# EAGLE design openSX70_SONAR-FBW_8-9-3-8-S4-TCS3200-NO-THERMAL-20200509 (EAGLE 9.6.1)
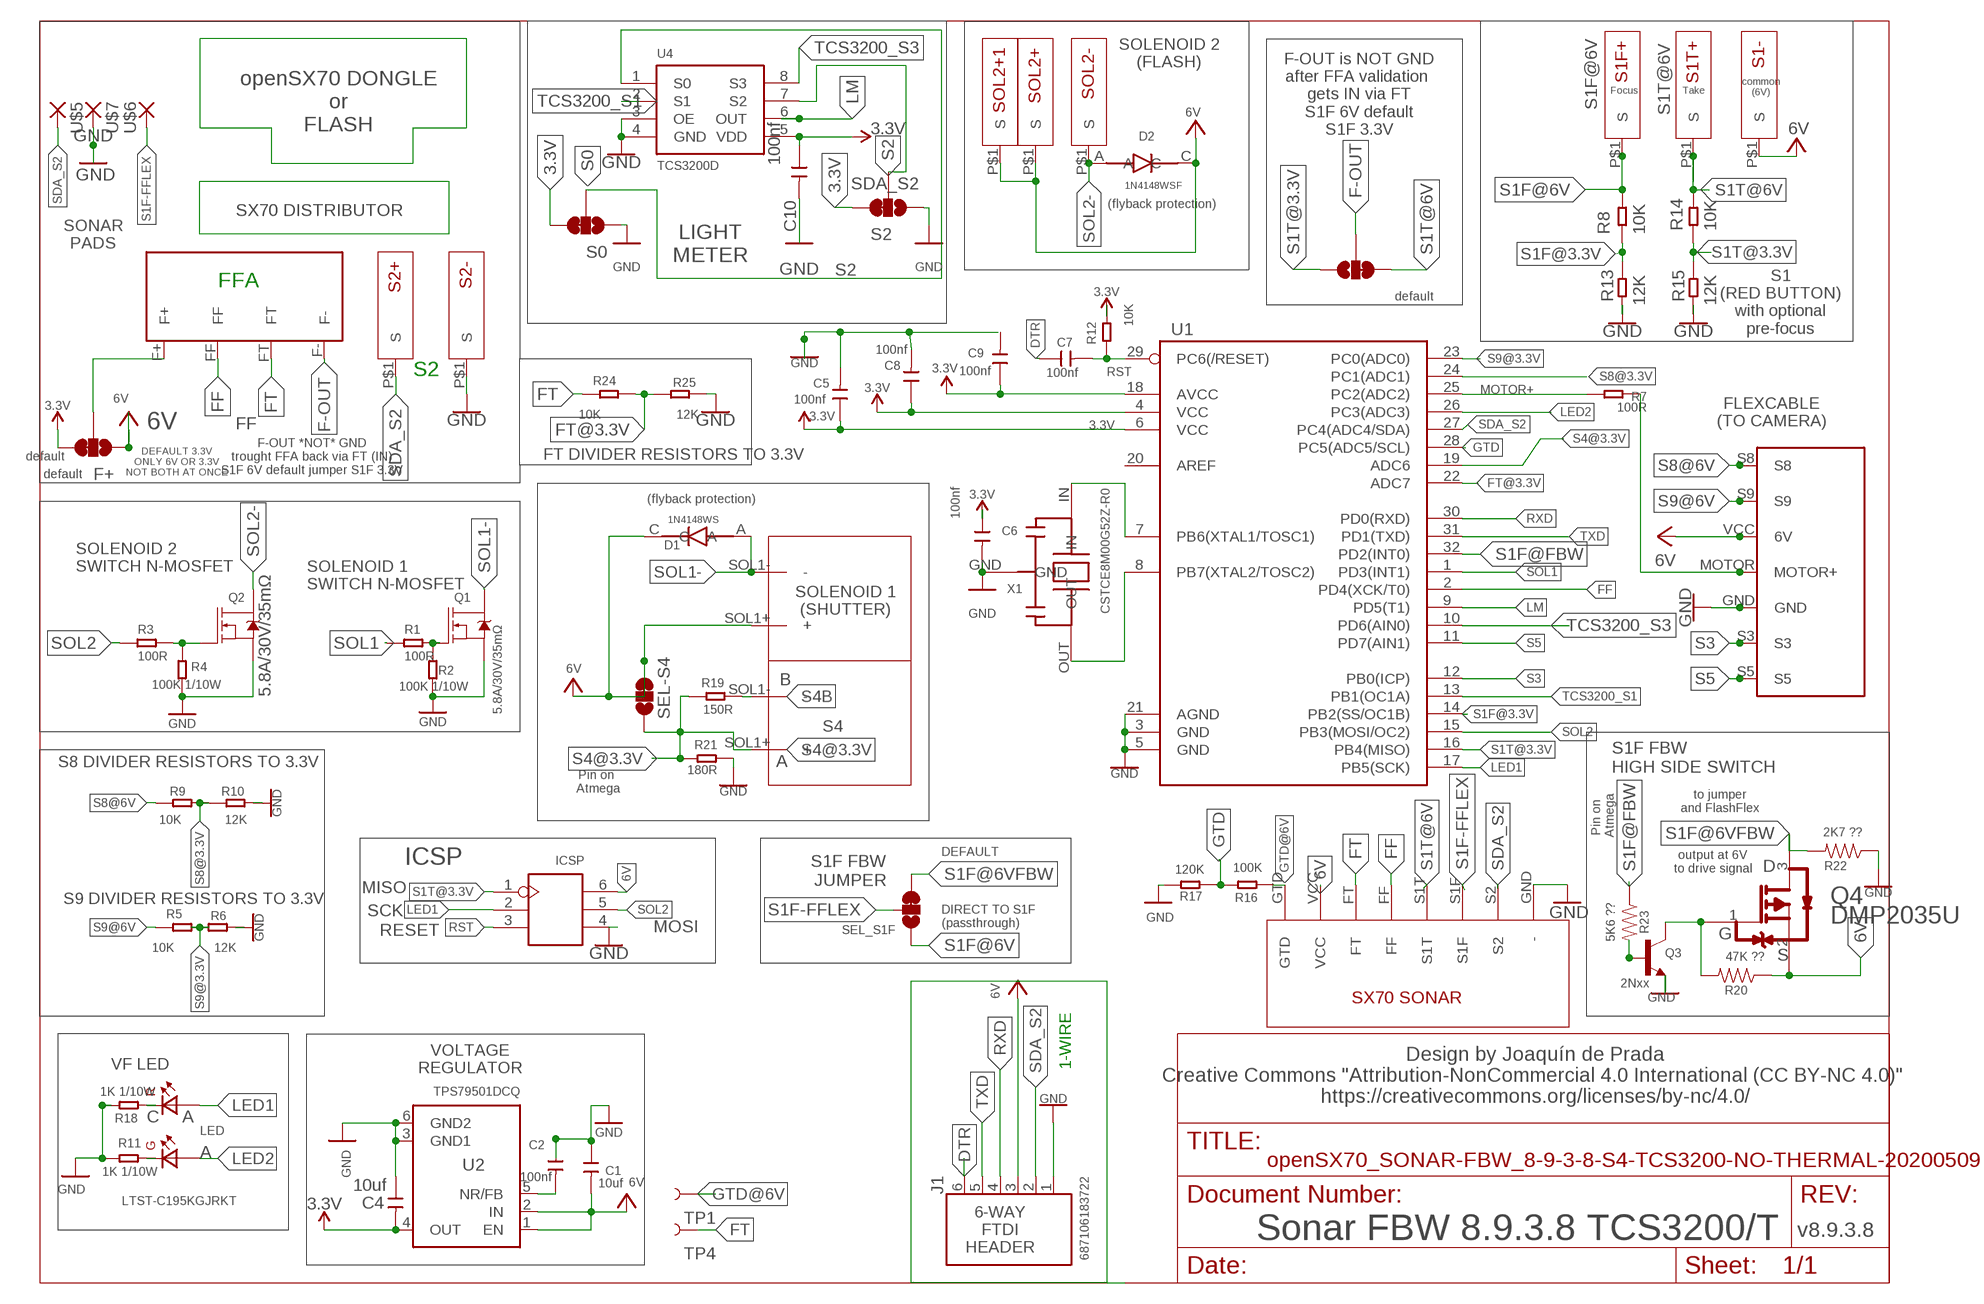
[diagram p0: schematic, sheet 1]

## Parts
C1  10uf  CERAMIC-10UF-10V-10%-X5R(0603)  [C0603]
C2  100nf  CERAMIC-100NF-50V-10%-X7R(0603)  [C0603]
C4  10uf  CERAMIC-10UF-10V-10%-X5R(0603)  [C0603]
C5  100nf  CERAMIC-100NF-50V-10%-X7R(0603)  [C0603]
C6  100nf  CERAMIC-100NF-50V-10%-X7R(0603)  [C0603]
C7  100nf  CERAMIC-100NF-50V-10%-X7R(0603)  [C0603]
C8  100nf  CERAMIC-100NF-50V-10%-X7R(0603)  [C0603]
C9  100nf  CERAMIC-100NF-50V-10%-X7R(0603)  [C0603]
C10  100nf  CERAMIC-100NF-50V-10%-X7R(0603)  [C0603]
D1  1N4148WS  [SODFL2512X100N]
D2  1N4148WSF  1N4148WS  [SODFL2512X100N]
F+  S0  JUMPER-SMT_3_1-NC_TRACE_SILK  [SMT-JUMPER_3_1-NC_TRACE_SILK]
ICSP  ICSP  [H2X3-2.54]
J1  687106183722  [687106183722]
LED  LTST-C195KGJRKT  [LTST-BILED-15X16]
Q1  5.8A/30V/35mΩ  MOSFET-NCH-AO3404A  [SOT23-3]
Q2  5.8A/30V/35mΩ  MOSFET-NCH-AO3404A  [SOT23-3]
Q3  BFR93-NPN-SOT23-BEC  [SOT23-BEC]
Q4  DIODES_INC._DMP2035UDIODES_INC._DMP2035U_0_2  [DIODES_INC._DMP2035U_2]
R1  100R  SMD-RES-100R-5%-1/10W(0603)  [R0603]
R2  100K 1/10W  SMD-RES-100K-5%-1/10W(0603)  [R0603]
R3  100R  SMD-RES-100R-5%-1/10W(0603)  [R0603]
R4  100K 1/10W  SMD-RES-100K-5%-1/10W(0603)  [R0603]
R5  10K  SMD-RES-15K-1%-1/10W(0603)  [R0603]
R6  12K  SMD-RES-10K-1%-1/10W(0603)  [R0603]
R7  100R  SMD-RES-100R-5%-1/10W(0603)  [R0603]
R8  10K  SMD-RES-10K-1%-1/10W(0603)  [R0603]
R9  10K  SMD-RES-15K-1%-1/10W(0603)  [R0603]
R10  12K  SMD-RES-10K-1%-1/10W(0603)  [R0603]
R11  1K 1/10W  SMD-RES-1K-5%-1/10W(0603)  [R0603]
R12  10K  SMD-RES-10K-1%-1/10W(0603)  [R0603]
R13  12K  SMD-RES-15K-1%-1/10W(0603)  [R0603]
R14  10K  SMD-RES-10K-1%-1/10W(0603)  [R0603]
R15  12K  SMD-RES-15K-1%-1/10W(0603)  [R0603]
R16  100K  SMD-RES-10K-1%-1/10W(0603)  [R0603]
R17  120K  SMD-RES-15K-1%-1/10W(0603)  [R0603]
R18  1K 1/10W  SMD-RES-1K-5%-1/10W(0603)  [R0603]
R19  150R  SMD-RES-10K-1%-1/10W(0603)  [R0603]
R20  47K  RESISTOR0603  [0603]
R21  180R  SMD-RES-10K-1%-1/10W(0603)  [R0603]
R22  2K7  RESISTOR0603  [0603]
R23  47K  RESISTOR0603  [0603]
R24  10K  SMD-RES-15K-1%-1/10W(0603)  [R0603]
R25  12K  SMD-RES-10K-1%-1/10W(0603)  [R0603]
S0  S0  JUMPER-SMT_3_1-NC_TRACE_SILK  [SMT-JUMPER_3_1-NC_TRACE_SILK]
S1-  SX70-S-PAD-NEW  [SX70-S-PAD2]
S1F+  SX70-S-PAD-NEW  [SX70-S-PAD2]
S1T+  SX70-S-PAD-NEW  [SX70-S-PAD2]
S2  S2  JUMPER-SMT_3_1-NC_TRACE_SILK  [SMT-JUMPER_3_1-NC_TRACE_SILK]
S2+  SX70-S-PAD-NEW  [SX70-S-PAD2]
S2-  SX70-S-PAD-NEW  [SX70-S-PAD2]
S4  SX70-SOLENOID1-2PADS  [SX70-SOLENOID1-2]
SEL_F-  SEL-S4  JUMPER-SMT_3_1-NC_TRACE_SILK  [SMT-JUMPER_3_1-NC_TRACE_SILK]
SEL_S1F  SEL-S4  JUMPER-SMT_3_1-NC_TRACE_SILK  [SMT-JUMPER_3_1-NC_TRACE_SILK]
SEL_S4  SEL-S4  JUMPER-SMT_3_1-NC_TRACE_SILK  [SMT-JUMPER_3_1-NC_TRACE_SILK]
SOL1  SX70-SOLENOID1-2PADS  [SX70-SOLENOID1-2]
SOL2+  SX70-S-PAD-NEW  [SX70-S-PAD2]
SOL2+1  SX70-S-PAD-NEW  [SX70-S-PAD2]
SOL2-  SX70-S-PAD-NEW  [SX70-S-PAD2]
TP1  TEST-POINT3X4  [PAD.03X.04]
TP4  TEST-POINT3X4  [PAD.03X.04]
U1  ATMEGA328P_32MLFATMEGA328-MLF  [MLF32]
U2  TPS79501DCQ  [SOT127P706X180-6N]
U4  TCS3200D  [SOIC8]
U$1  SX70-7-PAD  [SX70-7-PAD-PROPER]
U$2  FFA  SX70-FFA-PAD  [FFA-PAD-PACKAGE]
U$3  SX70-SONAR-FLASHFLEX  [SONAR-FLASHFLEX]
U$5  S2-SONAR  [S2-SONAR]
U$6  S1F@6V  S2-SONAR  [S2-SONAR]
U$7  GND-SONAR  [GND-SONAR]
X1  CSTCE8M00G52Z-R0  CSTCE16M0V53-R0  [CFP95P160X100-3N]

## Nets
3.3V: C4.2 C5.1 C6.1 C8.1 C9.1 C10.1 F+.3 R12.2 S0.3 S2.3 U1.4(VCC) U1.6(VCC) U1.18(AVCC) U2.4(OUT) U4.5(VDD)
6V: C1.2 D1.C D2.C F+.1 ICSP.6(VCC) J1.3 Q4.2(S) R20.1 S1-.P$1(S) SEL_S4.2 SEL_S4.3 SOL1.SOL1+(+) SOL2+1.P$1(S) SOL2+.P$1(S) U2.1(EN) U2.2(IN) U$1.VCC(6V) U$3.VCC
DTR: C7.1 J1.6
F-OUT: SEL_F-.2 U$2.F-
FF: U1.2(PD4(XCK/T0)) U$2.FF U$3.FF
FT: R24.1 TP4.P$1 U$2.FT U$3.FT
FT@3.3V: R24.2 R25.1 U1.22(ADC7)
GND: C1.1 C2.1 C4.1 C5.2 C6.2 C8.2 C10.2 ICSP.4(GND) J1.1 Q1.2(S) Q2.2(S) Q3.E R2.1 R4.1 R6.2 R10.2 R11.1 R13.1 R15.1 R17.1 R18.2 R21.1 R22.1 R25.2 S0.1 S2-.P$1(S) S2.1 U1.3(GND) U1.5(GND) U1.21(AGND) U2.3(GND1) U2.6(GND2) U4.3(OE) U4.4(GND) U$1.GND U$3.GND(-) U$7.GND-SONAR(P) X1.GND
GTD: R16.2 R17.2 U1.28(PC5(ADC5/SCL))
GTD@6V: R16.1 TP1.P$1 U$3.GTD
LED1: ICSP.2(SCK) LED.P$2(A2) U1.17(PB5(SCK))
LED2: LED.P$1(A1) U1.26(PC3(ADC3))
LM: U1.9(PD5(T1)) U4.6(OUT)
MOTOR+: R7.1 U1.25(PC2(ADC2))
MOTOR-HEADER: R7.2 U$1.MOTOR(MOTOR+)
N$1: Q1.1(G) R1.2 R2.2
N$2: LED.P$4(K2) R18.1
N$3: Q2.1(G) R3.2 R4.2
N$4: U1.7(PB6(XTAL1/TOSC1)) X1.IN
N$5: F+.2 U$2.F+
N$6: U1.8(PB7(XTAL2/TOSC2)) X1.OUT
N$7: Q3.C Q4.1(G) R20.2
N$8: Q3.B R23.2
N$10: C2.2 U2.5(NR/FB)
N$11: LED.P$3(K1) R11.2
RST: C7.2 ICSP.3(RST) R12.1 U1.29(PC6(/RESET))
RXD: J1.4 U1.30(PD0(RXD))
S0: S0.2 U4.1(S0)
S1F-FFLEX: SEL_S1F.2 U$3.S1F U$6.S2-SONAR(P)
S1F@3.3V: R8.1 R13.2 U1.14(PB2(SS/OC1B))
S1F@6V: R8.2 S1F+.P$1(S) SEL_S1F.1
S1F@6VFBW: Q4.3(D) R22.2 SEL_S1F.3
S1F@FBW: R23.1 U1.32(PD2(INT0))
S1T@3.3V: ICSP.1(MISO) R14.1 R15.2 SEL_F-.1 U1.16(PB4(MISO))
S1T@6V: R14.2 S1T+.P$1(S) SEL_F-.3 U$3.S1T
S2: S2.2 U4.7(S2)
S3: U1.12(PB0(ICP)) U$1.S3
S4@3.3V: R19.1 R21.2 S4.SOL1+(+) SEL_S4.1 U1.19(ADC6)
S4B: R19.2 S4.SOL1-(-)
S5: U1.11(PD7(AIN1)) U$1.S5
S8@3.3V: R9.2 R10.1 U1.24(PC1(ADC1))
S8@6V: R9.1 U$1.S8
S9@3.3V: R5.2 R6.1 U1.23(PC0(ADC0))
S9@6V: R5.1 U$1.S9
SDA_S2: J1.2 S2+.P$1(S) U1.27(PC4(ADC4/SDA)) U$3.S2 U$5.S2-SONAR(P)
SOL1: R1.1 U1.1(PD3(INT1))
SOL1-: D1.A Q1.3(D) SOL1.SOL1-(-)
SOL2: ICSP.5(MOSI) R3.1 U1.15(PB3(MOSI/OC2))
SOL2-: D2.A Q2.3(D) SOL2-.P$1(S)
TCS3200_S1: U1.13(PB1(OC1A)) U4.2(S1)
TCS3200_S3: U1.10(PD6(AIN0)) U4.8(S3)
TXD: J1.5 U1.31(PD1(TXD))
Unconnected: C9.2 U1.20(AREF)

## Notes on the sheet
- SOLENOID 2
  (FLASH)
- common
  (6V)
- Focus | Take
- F-OUT is NOT GND
  after FFA validation 
  gets IN via FT
  S1F 6V default
  S1F 3.3V
- openSX70 DONGLE
  or
  FLASH
- (flyback protection)
- SX70 DISTRIBUTOR
- SONAR
  PADS
- LIGHT
  METER
- FFA
- default
- S1
  (RED BUTTON)
  with optional
  pre-focus
- S2
- FLEXCABLE
  (TO CAMERA)
- default
- F-OUT *NOT* GND
  trought FFA back via FT (IN)
  S1F 6V default jumper S1F 3.3V
- FT DIVIDER RESISTORS TO 3.3V
- DEFAULT 3.3V
  ONLY 6V OR 3.3V
  NOT BOTH AT ONCE
- default
- (flyback protection)
- SOLENOID 2
  SWITCH N-MOSFET
- SOLENOID 1
  SWITCH N-MOSFET
- SOLENOID 1
  (SHUTTER)
- B
- S4
- S8 DIVIDER RESISTORS TO 3.3V | A
- S1F FBW 
  HIGH SIDE SWITCH
- Pin on 
  Atmega
- to jumper
  and FlashFlex
- Pin on 
  Atmega
- 2K7 ??
- DEFAULT
- output at 6V
  to drive signal
- S1F FBW 
  JUMPER
- D
- MISO
- S9 DIVIDER RESISTORS TO 3.3V
- SCK
- DIRECT TO S1F 
  (passthrough)
- RESET | MOSI | SEL_S1F
- 5K6 ?? | G
- 47K ?? | S
- 2Nxx
- VOLTAGE
  REGULATOR
- 1-WIRE
- Design by Joaquín de Prada
  Creative Commons "Attribution-NonCommercial 4.0 International (CC BY-NC 4.0)" 
  https://creativecommons.org/licenses/by-nc/4.0/
- VF LED
- C | A
- A
- 6-WAY
  FTDI
  HEADER
- v8.9.3.8
- Sonar FBW 8.9.3.8 TCS3200/T

## Library data of the parts
C1 C4 = Seeed-Capacitor:CERAMIC-10UF-10V-10%-X5R(0603): 302010103; MPN: CC0603KRX5R6BB106
C2 C5-C10 = Seeed-Capacitor:CERAMIC-100NF-50V-10%-X7R(0603): 302010138; MPN: CC0603KRX7R9BB104
D1 D2 = Common-Parts-Library-Eagle:1N4148WS: 1N4148WS Series 75 V 300 mA Surface Mount Small Signal Diodes - SOD-323F; MANUFACTURER: Fairchild Semiconductor
F+ S0 S2 SEL_F- SEL_S1F SEL_S4 = SparkFun-Jumpers:JUMPER-SMT_3_1-NC_TRACE: Normally closed trace jumper (1 of 2 connections) This jumper has a trace between two pads so it's normally closed (NC). The other connection is normally open (NO). Use a razor knife to open the connection. For best results follow the IPC guidelines for cutting traces: Cutout at least 0.063 mm (0.005 in). Remove all loose material to clean up the cut area. Seal the cut with an approved epoxy. Reapply solder to reclose the connection, or to close the NO connection.
ICSP = openSX70:ICSP
J1 = 687106183722:687106183722: 687106183722 WR-FPC 0.50mm SMT Horizontal Bottom Contact - Low Profile Details see: http://katalog.we-online.de/en/em/FPC_0_5_SMT_ZIF_HORIZONTAL_BOTTOM_CONTACT_LOW_PROFILE_6871xx183722 Created by Yingchun,shan 2016 (C) Wurth Elektronik; AVAILABILITY: Good; DESCRIPTION: CONN FFC BTM 6POS 0.5MM SMD R/A; MF: Wurth Electronics; MP: 687106183722; PACKAGE: None; PRICE: 1.21 USD
LED = LTST-C195KGJRKT:LTST-C195KGJRKT; AVAILABILITY: Unavailable; DESCRIPTION: Green/Red 130° Water Clear 35/25 mcd 2 V 0605 Surface Mount Bi-Color LED; MF: Lite-On Inc.; MP: LTST-C195KGJRKT; PACKAGE: 0606 Lite-On; PRICE: None
Q1 Q2 = openSX70:MOSFET-NCH: N-channel MOSFETs Voltage controlled devices that allow control of high current outputs. SparkFun Products: SparkFun OpenScale <https://www.sparkfun.com/products/13261> SparkFun Digital Sandbox <https://www.sparkfun.com/products/12651> SparkFun Monster Moto Shield <https://www.sparkfun.com/products/10182> SparkFun MOSFET Power Controller <https://www.sparkfun.com/products/11214>; PROD_ID: TRANS-12988
Q3 = transistor-neu-to92:*-NPN-: NPN Transistror
Q4 = _openSX70:DIODES_INC._DMP2035U: MOSFET P-CH 20V 3.6A SOT-23; AUTOMOTIVE: No; CENTROID_NOT_SPECIFIED: No; CONTINUOUS_DRAIN_CURRENT: -4.9A; DATASHEET: https://www.diodes.com/assets/Datasheets/DMP2035U.pdf; DEPLETION_MODE: False; DEVICE_CLASS_L1: Discrete Semiconductors; DEVICE_CLASS_L2: Transistors; DEVICE_CLASS_L3: MOSFETs; DIGIKEY_DESCRIPTION: TRANS MOSFET P-CH 20V 3.6A SOT-23; DIGIKEY_PART_NUMBER: DMP2035U-7DICT-ND; DRAIN_TO_SOURCE_BREAKDOWN_VOLTAGE: -20V; DRAIN_TO_SOURCE_RESISTANCE: 23mΩ; DRAIN_TO_SOURCE_VOLTAGE: -20V; FOOTPRINT_PARAMETERS_1: {"fp_type":"SOT23","params":{"N":{"default":"3","long name":"Number of leads","type":"multichoice","short name":"N"},"A":{"nom":1024999,"long name":"Height","min":903000,"max":1100000,"short name":"A","type":"measurement"},"A1":{"nom":50000,"long name":"Package clearance","min":13000,"max":100000,"short name":"A1","type":"measurement"},"A2":{"nom":975000,"long name":"Package height","min":890000,"max":1000000,"short name":"A2","type":"measurement"},"D":{"nom":2900000,"long name":"Package length","min":2800000,"max":3000000,"short name":"D","type":"measurement"},"E":{"nom":2400000,"long name":"Width /w leads","min":2300000,"max":2500000,"short name":"E","type":"measurement"},"E1":{"nom":1300000,"long name":"Package width","min":1200000,"max":1400000,"short name":"E1","type":"measurement"},"B":{"nom":400000,"long name":"Lead width","min":370000,"max":510000,"short name":"B","type":"measurement"},"C":{"nom":110000,"long name":"Lead thickness","min":85000,"max":150000,"short name":"C","type":"measurement"},"L":{"nom":400000,"long name":"Lead foot length","min":250000,"max":550000,"short name":"L","type":"measurement"},"e":{"nom":915000,"long name":"Lead pitch","min":null,"max":null,"short name":"e","type":"measurement"},"PHI":{"nom":false,"long name":"Lead angle","min":0,"max":8,"short name":"PHI","type":"measurement"},"offset x":{"nom":0,"long name":"X Center offset","min":null,"max":null,"short name":"offset x","type":"measurement"},"offset y":{"nom":0,"long name":"Y Center offset","min":null,"max":null,"short name":"offset y","type":"measurement"},"LS":{"default":"Rounded rectangle","long name":"Land shape","type":"multichoice","short name":"LS"},"LS1":{"default":"Rectangle","long name":"Land shape (Pin 1)","type":"multichoice","short name":"LS1"},"solder toe":{"nom":550000,"long name":"Solder fillet (toe)","min":null,"max":null,"short name":"solder toe","type":"fixedmeasurement"},"solder heel":{"nom":450000,"long name":"Solder fillet (heel)","min":null,"max":null,"short name":"solder heel","type":"fixedmeasurement"},"solder side":{"nom":50000,"long name":"Solder fillet (side)","min":null,"max":null,"short name":"solder side","type":"fixedmeasurement"},"courtyard":{"nom":500000,"long name":"Courtyard","min":null,"max":null,"short name":"courtyard","type":"fixedmeasurement"},"SF":{"default":"A","long name":"Packing level","type":"multichoiceparent","short name":"SF","help":"http://support.upverter.com/customer/portal/articles/978783-what-is-a-footprint-packing-level","children":["solder toe","solder heel","solder side","courtyard"]}}}; FOOTPRINT_PARAMETERS_2: {"fp_type":"SOT23","params":{"N":{"default":"3","long name":"Number of leads","type":"multichoice","short name":"N"},"A":{"nom":1024999,"long name":"Height","min":903000,"max":1100000,"short name":"A","type":"measurement"},"A1":{"nom":50000,"long name":"Package clearance","min":13000,"max":100000,"short name":"A1","type":"measurement"},"A2":{"nom":975000,"long name":"Package height","min":890000,"max":1000000,"short name":"A2","type":"measurement"},"D":{"nom":2900000,"long name":"Package length","min":2800000,"max":3000000,"short name":"D","type":"measurement"},"E":{"nom":2400000,"long name":"Width /w leads","min":2300000,"max":2500000,"short name":"E","type":"measurement"},"E1":{"nom":1300000,"long name":"Package width","min":1200000,"max":1400000,"short name":"E1","type":"measurement"},"B":{"nom":400000,"long name":"Lead width","min":370000,"max":510000,"short name":"B","type":"measurement"},"C":{"nom":110000,"long name":"Lead thickness","min":85000,"max":150000,"short name":"C","type":"measurement"},"L":{"nom":400000,"long name":"Lead foot length","min":250000,"max":550000,"short name":"L","type":"measurement"},"e":{"nom":915000,"long name":"Lead pitch","min":null,"max":null,"short name":"e","type":"measurement"},"PHI":{"nom":false,"long name":"Lead angle","min":0,"max":8,"short name":"PHI","type":"measurement"},"offset x":{"nom":0,"long name":"X Center offset","min":null,"max":null,"short name":"offset x","type":"measurement"},"offset y":{"nom":0,"long name":"Y Center offset","min":null,"max":null,"short name":"offset y","type":"measurement"},"LS":{"default":"Rounded rectangle","long name":"Land shape","type":"multichoice","short name":"LS"},"LS1":{"default":"Rectangle","long name":"Land shape (Pin 1)","type":"multichoice","short name":"LS1"},"solder toe":{"nom":350000,"long name":"Solder fillet (toe)","min":null,"max":null,"short name":"solder toe","type":"fixedmeasurement"},"solder heel":{"nom":350000,"long name":"Solder fillet (heel)","min":null,"max":null,"short name":"solder heel","type":"fixedmeasurement"},"solder side":{"nom":30000,"long name":"Solder fillet (side)","min":null,"max":null,"short name":"solder side","type":"fixedmeasurement"},"courtyard":{"nom":250000,"long name":"Courtyard","min":null,"max":null,"short name":"courtyard","type":"fixedmeasurement"},"SF":{"default":"B","long name":"Packing level","type":"multichoiceparent","short name":"SF","help":"http://support.upverter.com/customer/portal/articles/978783-what-is-a-footprint-packing-level","children":["solder toe","solder heel","solder side","courtyard"]}}}; FOOTPRINT_PARAMETERS_3: {"fp_type":"SOT23","params":{"N":{"default":"3","long name":"Number of leads","type":"multichoice","short name":"N"},"A":{"nom":1024999,"long name":"Height","min":903000,"max":1100000,"short name":"A","type":"measurement"},"A1":{"nom":50000,"long name":"Package clearance","min":13000,"max":100000,"short name":"A1","type":"measurement"},"A2":{"nom":975000,"long name":"Package height","min":890000,"max":1000000,"short name":"A2","type":"measurement"},"D":{"nom":2900000,"long name":"Package length","min":2800000,"max":3000000,"short name":"D","type":"measurement"},"E":{"nom":2400000,"long name":"Width /w leads","min":2300000,"max":2500000,"short name":"E","type":"measurement"},"E1":{"nom":1300000,"long name":"Package width","min":1200000,"max":1400000,"short name":"E1","type":"measurement"},"B":{"nom":400000,"long name":"Lead width","min":370000,"max":510000,"short name":"B","type":"measurement"},"C":{"nom":110000,"long name":"Lead thickness","min":85000,"max":150000,"short name":"C","type":"measurement"},"L":{"nom":400000,"long name":"Lead foot length","min":250000,"max":550000,"short name":"L","type":"measurement"},"e":{"nom":915000,"long name":"Lead pitch","min":null,"max":null,"short name":"e","type":"measurement"},"PHI":{"nom":false,"long name":"Lead angle","min":0,"max":8,"short name":"PHI","type":"measurement"},"offset x":{"nom":0,"long name":"X Center offset","min":null,"max":null,"short name":"offset x","type":"measurement"},"offset y":{"nom":0,"long name":"Y Center offset","min":null,"max":null,"short name":"offset y","type":"measurement"},"LS":{"default":"Rounded rectangle","long name":"Land shape","type":"multichoice","short name":"LS"},"LS1":{"default":"Rectangle","long name":"Land shape (Pin 1)","type":"multichoice","short name":"LS1"},"solder toe":{"nom":150000,"long name":"Solder fillet (toe)","min":null,"max":null,"short name":"solder toe","type":"fixedmeasurement"},"solder heel":{"nom":250000,"long name":"Solder fillet (heel)","min":null,"max":null,"short name":"solder heel","type":"fixedmeasurement"},"solder side":{"nom":10000,"long name":"Solder fillet (side)","min":null,"max":null,"short name":"solder side","type":"fixedmeasurement"},"courtyard":{"nom":100000,"long name":"Courtyard","min":null,"max":null,"short name":"courtyard","type":"fixedmeasurement"},"SF":{"default":"C","long name":"Packing level","type":"multichoiceparent","short name":"SF","help":"http://support.upverter.com/customer/portal/articles/978783-what-is-a-footprint-packing-level","children":["solder toe","solder heel","solder side","courtyard"]}}}; FOOTPRINT_URL: https://www.diodes.com/assets/Package-Files/SOT23.pdf; FOOTPRINT_VARIANT_NAME_0: Recommended_Land_Pattern; FOOTPRINT_VARIANT_NAME_1: IPC_A; FOOTPRINT_VARIANT_NAME_2: IPC_B; FOOTPRINT_VARIANT_NAME_3: IPC_C; GATE_CHARGE_AT_VGS: 15.4nC @ -4.5V; GATE_TO_SOURCE_VOLTAGE: 10V; HEIGHT: 1.1mm; INPUT_CAPACITACE_AT_VDS: 1610pF @ -10V; IPC_LAND_PATTERN_NAME: SOT92P240X102-3; LEAD_FREE: Yes; MAX_FORWARD_DIODE_VOLTAGE: -1V; MAX_JUNCTION_TEMP: +150°C; MF: Diodes Inc.; MFG_PACKAGE_IDENT: SOT23; MFG_PACKAGE_IDENT_DATE: 01/2017; MFG_PACKAGE_IDENT_REV: 0; MOUSER_DESCRIPTION: MOSFET P-CH 20V 3.6A SOT-23; MOUSER_PART_NUMBER: 621-DMP2035U-7; MPN: DMP2035U; NUMBER_OF_CHANNELS: 1; NUMBER_OF_P_CHANNELS: 1; PACKAGE: SOT23-3; POWER_DISSIPATION: 0.81W; PREFIX: Q; PULSE_DRAIN_CURRENT: -24A; ROHS: Yes; RTHJA_MAX: 153.5°C/W; STANDOFF_HEIGHT: 0.013mm; TEMPERATURE_RANGE_HIGH: +150°C; TEMPERATURE_RANGE_LOW: -55°C; THRESHOLD_VGS_MAX: -1V; THRESHOLD_VGS_MIN: -0.4V; TRANSCONDUCTANCE: 14S; TURN_OFF_DELAY_TIME: 94.1ns; TURN_ON_DELAY_TIME: 16.8ns; TYP_FORWARD_DIODE_VOLTAGE: -0.7V; VERIFICATION_VERSION: 0.0.0.1
R1 R3 R7 = Seeed-Resistor:SMD-RES-100R-5%-1/10W(0603): 301010090; MPN: RC0603JR-07100RL
R2 R4 = Seeed-Resistor:SMD-RES-100K-5%-1/10W(0603): 301010089; MPN: RC0603JR-07100KL
R5 R9 R13 R15 R17 R24 = Seeed-Resistor:SMD-RES-15K-1%-1/10W(0603): 301010241; MPN: RC0603FR-0715KL; VALUE: 15K 1/10W
R6 R10 R16 R19 R21 R25 = Seeed-Resistor:SMD-RES-10K-1%-1/10W(0603): 301010299; MPN: RC0603FR-0710KL; VALUE: 10K
R8 R12 R14 = Seeed-Resistor:SMD-RES-10K-1%-1/10W(0603): 301010299; MPN: RC0603FR-0710KL
R11 R18 = Seeed-Resistor:SMD-RES-1K-5%-1/10W(0603): 301010291; MPN: RC0603JR-071KL
R20 R22 R23 = SparkFun-Resistors:RESISTOR: Generic Resistor Package
S1- S1F+ S1T+ S2+ S2- SOL2+ SOL2+1 SOL2- = openSX70:SX70-S-PAD-NEW
S4 SOL1 = openSX70:SX70-SOLENOID1-2PADS
TP1 TP4 = SparkFun-Connectors:TEST-POINT: SparkFun Test Points Bare copper test points for troubleshooting or In-Circuit-Testing. These are used by our Production team for verifying production board runs using pogo-pins on test beds. SparkFun Products: SparkFun LSM9DS1 Breakout <https://www.sparkfun.com/products/13284> SparkFun PSOC <https://www.sparkfun.com/products/13714> SparkFun Load Cell Amplifier <https://www.sparkfun.com/products/13879>
U1 = _openSX70:ATMEGA328P_32MLF: Popular 328P in QFP Storefront component: ATmega328 - TQFP (COM-13448) Datasheet SparkFun Products SparkFun RedBoard - Programmed with Arduino (DEV-12757) Arduino Pro Mini 328 - 5V/16MHz (DEV-11113) Arduino Pro Mini 328 - 3.3V/8MHz (DEV-11114) SparkFun OpenLog (DEV-13712) SparkFun MicroView - OLED Arduino Module (DEV-12923) SparkFun Digital Sandbox (DEV-12651) SparkFun PicoBoard (WIG-11888) Arduino Fio (DEV-10116) LilyPad Arduino 328 Main Board (DEV-13342) SparkFun RedStick (DEV-13741) LilyPad MP3 (DEV-11013) LilyPad Arduino SimpleSnap (DEV-10941) SparkFun Stepoko (ROB-13899) SparkFun Geiger Counter (SEN-11345) SparkFun EL Sequencer (COM-12781) Arduino Pro 328 - 5V/16MHz (DEV-10915) CryptoCape (DEV-12773) SparkFun IR Thermometer Evaluation Board - MLX90614 (SEN-10740) SparkFun RedBot Mainboard (ROB-12097) Arduino Pro 328 - 3.3V/8MHz (DEV-10914) SparkFun Block for Intel® Edison - Arduino (DEV-13036) SparkFun Simon Says - Surface Mount Soldering Kit (KIT-10935) SparkFun 7-Segment Serial Display - Red (COM-11441) SparkFun 7-Segment Serial Display - White (COM-11629) SparkFun 7-Segment Serial Display - Yellow (COM-11443) SparkFun 7-Segment Serial Display - Kelly Green (COM-11440) SparkFun 7-Segment Serial Display - Blue (COM-11442) SparkFun OpenSegment Serial Display - 20mm (Blue) (COM-11647) SparkFun OpenSegment Serial Display - 20mm (Green) (COM-11646) SparkFun OpenSegment Serial Display - 20mm (White) (COM-11648) SparkFun OpenSegment Serial Display - 20mm (Red) (COM-11644) SparkFun OpenSegment Serial Display - 20mm (Yellow) (COM-11645) SparkFun OpenSegment Shield (DEV-13190)
U2 = TPS79501DCQ:TPS79501DCQ: Ultralow-Noise, High-PSRR, Fast, RF, 500-mA Low-Dropout Linear Regulators 6-SOT-223 -40 to 125; DESCRIPTION: Ultralow-Noise, High-PSRR, Fast, RF, 500-mA Low-Dropout Linear Regulators 6-SOT-223 -40 to 125; DIGI-KEY_PART_NUMBER: 296-27102-5-ND; DIGI-KEY_PURCHASE_URL: https://www.digikey.com/product-detail/en/texas-instruments/TPS79501DCQ/296-27102-5-ND/1908443?utm_source=snapeda&utm_medium=aggregator&utm_campaign=symbol; MF: Texas Instruments; MP: TPS79501DCQ; PACKAGE: SOT-223-6 Texas Instruments
U4 = TCS3200D:TCS3200D; AVAILABILITY: Unavailable; DESCRIPTION: TSL3200 Series 5.5 V Programmable Color Light-To-Frequency Converter - SOIC-8; MF: ams; MP: TCS3200D-TR; PACKAGE: SOIC-8 ams; PRICE: None
U$1 = _openSX70:SX70-7-PAD
U$2 = openSX70:SX70-FFA-PAD
U$3 = _openSX70:SX70-SONAR-FLASHFLEX
U$5 U$6 = _openSX70:S2-SONAR
U$7 = _openSX70:GND-SONAR
X1 = CSTCE16M0V53-R0:CSTCE16M0V53-R0: Ceramic Resonator 16MHz ±0.5% (Tol) ±0.3% (Stability) 15pF 40Ohm 3-Pin CSMD T/R; AVAILABILITY: Good; DESCRIPTION: Ceramic Resonator 16MHz ??0.5% (Tol) ??0.3% (Stability) 15pF 40Ohm 3-Pin CSMD T/R; MF: Murata; MP: CSTCE16M0V53-R0; PACKAGE: SMD-3 Murata; PRICE: 0.28 USD

## Net classes
0 default: width 0.254 mm
1 GND: width 0.61 mm

## Board
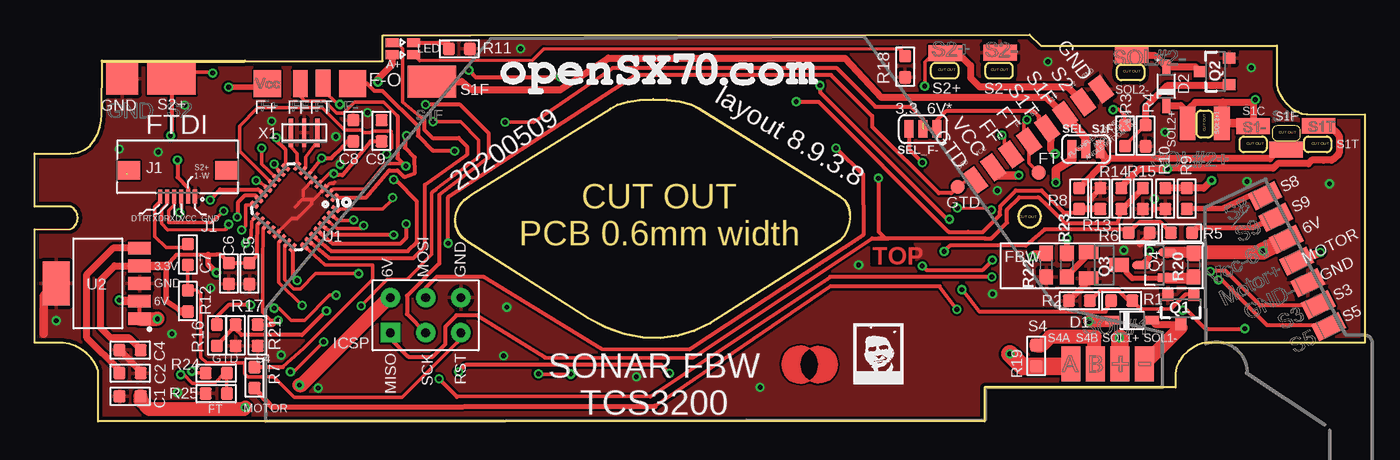
[diagram p1: board, top side]
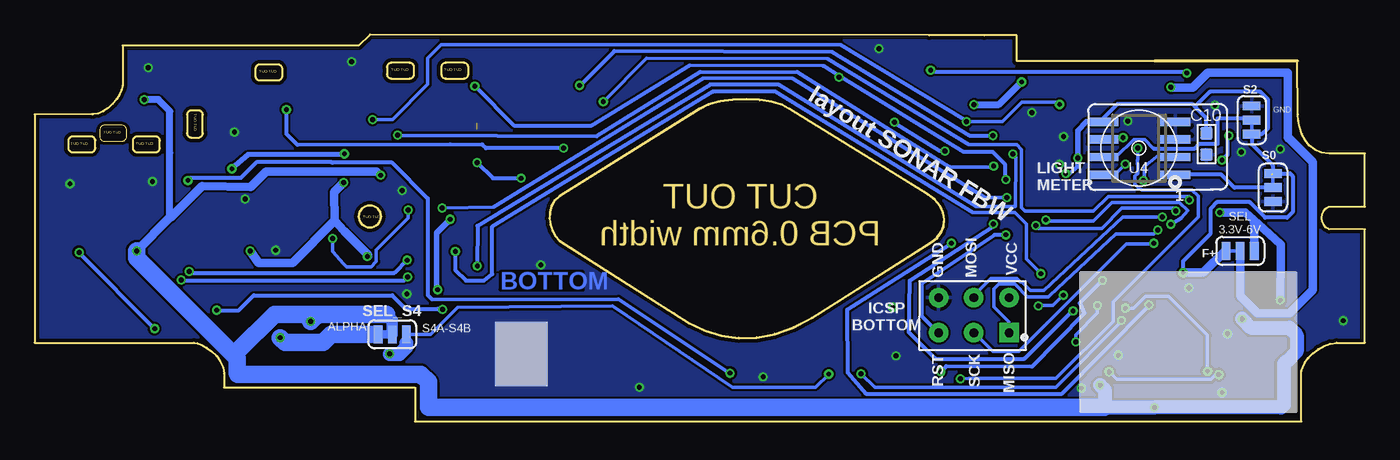
[diagram p2: board, bottom side, seen from below]

Size 95.88 x 27.9 mm. Coordinates in mm from the lower left corner, seen from the top.
Outline: 705 segments
Copper layers (1*16): Top 0.035mm / dielectric 1.5mm / Bottom 0.035mm
Design rules "SeeedStudio_2layer_DRU_no_angle_20140221": minimum track width 6mil, minimum drill 12mil, track to track 6mil, track to pad 6mil, pad to pad 6mil, via to via 6mil, smd to smd 0mil, copper to edge 10mil, drill to drill 10mil, minimum pad ring 10mil, minimum via ring 6mil, stop-mask expansion 2mil, vias tented up to drill 100mil, thermal gap 10mil

### Footprints (pad centres in the part's own frame; a part is rotated, then mirrored left to right if it is on the bottom)
C0603 = smd 0.889 x 0.889: 1 0,0.762; 2 0,-0.762
SODFL2512X100N = smd 1.05 x 0.6: A 1.4,0; C -1.4,0
SMT-JUMPER_3_1-NC_TRACE_SILK = smd 0.635 x 1.27: 1 -1.016,0; 2 0,0; 3 1.016,0
H2X3-2.54 = drill 0.635 pad 1.397 square: 1 -1.27,2.54 | drill 0.635 pad 1.397: 2 -1.27,0; 3 -1.27,-2.54; 4 1.27,-2.54; 5 1.27,0; 6 1.27,2.54
687106183722 = smd 0.3 x 1: 1 -1.25,1.9; 2 -0.75,1.9; 3 -0.25,1.9; 4 0.25,1.9; 5 0.75,1.9; 6 1.25,1.9 | smd 1.65 x 1.3: Z1 -3.525,0; Z2 3.525,0
LTST-BILED-15X16 = smd 0.65 x 0.952: P$1 0.425,0.776; P$2 -0.425,0.776; P$3 0.425,-0.776; P$4 -0.425,-0.776
SOT23-3 = smd 0.8 x 0.9: 1 -0.95,-1; 2 0.95,-1; 3 0,1.1
SOT23-BEC = smd 1 x 1.4: B -0.95,-1.1; C 0,1.1; E 0.95,-1.1
DIODES_INC._DMP2035U_2 = smd 1.359 x 0.587: 1 -0.927,0.915; 2 -0.927,-0.915; 3 0.927,0
R0603 = smd 0.889 x 0.889: 1 0,0.762; 2 0,-0.762
0603 = smd 1.1 x 1: 1 -0.85,0; 2 0.85,0
SX70-S-PAD2 = smd 2.413 x 1.143: P$1 0.01,0.087
SX70-SOLENOID1-2 = smd 1.372 x 2.54: SOL1+ -0.826,0.127; SOL1- 0.953,0.127
PAD.03X.04 = smd 1.016 x 1.016: P$1 0,0
MLF32 = smd 0.7 x 0.3: 1 -2.35,1.75; 2 -2.35,1.25; 3 -2.35,0.75; 4 -2.35,0.25; 5 -2.35,-0.25; 6 -2.35,-0.75; 7 -2.35,-1.25; 8 -2.35,-1.75; 17 2.35,-1.75; 18 2.35,-1.25; 19 2.35,-0.75; 20 2.35,-0.25; 21 2.35,0.25; 22 2.35,0.75; 23 2.35,1.25; 24 2.35,1.75 | smd 0.3 x 0.7: 9 -1.75,-2.35; 10 -1.25,-2.35; 11 -0.75,-2.35; 12 -0.25,-2.35; 13 0.25,-2.35; 14 0.75,-2.35; 15 1.25,-2.35; 16 1.75,-2.35; 25 1.75,2.35; 26 1.25,2.35; 27 0.75,2.35; 28 0.25,2.35; 29 -0.25,2.35; 30 -0.75,2.35; 31 -1.25,2.35; 32 -1.75,2.35
SOT127P706X180-6N = smd 0.92 x 1.61: 1 -2.54,-3.005; 2 -1.27,-3.005; 3 0,-3.005; 4 1.27,-3.005; 5 2.54,-3.005 | smd 3.16 x 1.97: 6 0,3.005
SOIC8 = smd 2.2 x 0.6: 1 -2.6,1.905; 2 -2.6,0.635; 3 -2.6,-0.635; 4 -2.6,-1.905; 5 2.6,-1.905; 6 2.6,-0.635; 7 2.6,0.635; 8 2.6,1.905
SX70-7-PAD-PROPER = smd 1.31 x 2.159: GND 7.875,1.312; MOTOR 6.125,1.312; S3 9.625,1.312; S5 11.375,1.312; S8 0.875,1.312; S9 2.625,1.312; VCC 4.375,1.312
FFA-PAD-PACKAGE = smd 1.95 x 1.95: F+ -3.277,-0.013; F- 2.87,0 | smd 1.05 x 1.95: FF -0.914,0; FT 0.737,0.025
SONAR-FLASHFLEX = smd 1.06 x 1.78: FF -4.8,-0.8; FT -3.2,-0.8; GND 3.2,-0.8; GTD -8,-0.8; S1F 0,-0.8; S1T -1.6,-0.8; S2 1.6,-0.8; VCC -6.4,-0.8
S2-SONAR = smd 3.5 x 2.31: S2-SONAR 0,0
GND-SONAR = smd 2.31 x 2.31: GND-SONAR 0,0
CFP95P160X100-3N = smd 0.3 x 2.032: GND 0.038,0.175; IN -0.912,0.177; OUT 0.992,0.174

### Placement (x,y rotation side)
C1  6.88,1.82 90 top
C2  6.88,3.48 270 top
C4  6.88,5.15 90 top
C5  15.48,10.67 0 top
C6  13.99,10.68 0 top
C7  11.04,12.05 0 top
C8  22.97,20.97 180 top
C9  25,20.97 180 top
C10  11.42,20.02 0 bottom
D1  79.09,7.31 0 top
D2  81.58,24.18 90 top
F+  8.99,12.3 180 bottom
ICSP  28.18,7.67 90 top
J1  10.31,18.12 180 top
LED  26.54,26.89 90 top
Q1  82.62,8.16 180 top
Q2  85.11,25.25 90 top
Q3  77.08,11.28 270 top
Q4  80.72,11.28 180 top
R1  78.36,8.71 90 top
R2  75.31,8.71 90 top
R3  78.59,20.62 0 top
R4  80.07,20.61 180 top
R5  82.67,13.61 270 top
R6  79.61,13.61 90 top
R7  15.85,3.16 0 top
R8  75.3,16.08 180 top
R9  83.05,16.08 180 top
R10  81.5,16.08 0 top
R11  30.61,26.88 270 top
R12  11.04,8.69 0 top
R13  76.82,16.08 0 top
R14  78.33,16.08 180 top
R15  79.88,16.08 180 top
R16  13.14,6.22 0 top
R17  14.48,6.22 180 top
R18  62.74,25.59 0 top
R19  72.2,4.74 180 top
R20  83.54,11.28 270 top
R21  16.06,6.22 180 top
R22  72.91,11.28 90 top
R23  74.4,11.28 270 top
R24  13.09,3.49 90 top
R25  13.09,2.01 270 top
S0  6.62,16.87 90 bottom
S1-  87.83,21.21 0 top
S1F+  90.21,19.52 0 top
S1T+  92.54,21.24 0 top
S2  8.15,21.75 270 bottom
S2+  65.62,26.47 0 top
S2-  69.58,26.51 0 top
S4  75.51,4.03 0 top
SEL_F-  64.03,21.1 0 top
SEL_S1F  75.78,19.65 180 top
SEL_S4  70.1,6.29 180 bottom
SOL1  79.05,4.03 0 top
SOL2+  83.19,21.51 90 top
SOL2+1  85.65,21.51 90 top
SOL2-  79.05,26.33 0 top
TP1  66.55,16.93 90 top
TP4  72.35,17.96 0 top
U1  18.77,15.48 230 top
U2  4.56,9.96 90 top
U4  16.27,19.71 180 bottom
U$1  87.13,16.5 296 top
U$2  20.05,24.38 0 top
U$3  73.8,22.74 36 top
U$5  9.86,24.72 0 top
U$6  28.64,24.52 0 top
U$7  6.32,24.75 0 top
U$8  SONAR-LOGO  [SONAR-LOGO]  54.79,17.28 0 top
X1  19.46,21 180 top

### Tracks (layer width: path | path; a pad name or v marks a point on that pad's centre or on a via)
3.3V  (via drill 0.35)  (1 unrouted)
  Top 0.254: 21.32,17.89 21.28,17.93 U1.4 | C8.1 22.97,20.22 22.53,20.23 | U1.6 | 14.02,11.41 C6.1
  Top 0.305: C9.1 24.2,20.21 22.19,17.76 21.56,17.76 v21.56,17.87 21.54,17.89 21.32,17.89 | 13.09,12.04 12.49,12.04 11.95,12.04 10.23,12.05 9.51,11.23 9.47,11.28 | 13.09,12.04 13.39,12.04 C6.1 14.62,11.44 | 13.09,12.04 | 14.02,11.41 C5.1 16,11.95 16,12.81 16.05,14.18 16.29,14.41 U1.18 | 22.53,20.23 22.19,19.81 21.37,18.99 v20.69,18.99 20.53,18.82 U1.6
  Top 0.406: 10.61,7.92 9.46,8.71 9.47,11.28 | v13.1,10.73 12.49,11.34 12.49,12.04
  Top 0.508: C4.2 7.64,5.2 6.82,6.02 5.49,6.02 4.74,6.76 4.74,10.2 5.77,11.23 U2.4
  Top 0.61: U2.4 9.51,11.23 | R12.2 10.61,7.92
  Bottom 0.254: 11.15,21.21 C10.1
  Bottom 0.305: v13.1,10.73 13.1,11.58 11.1,13.58 11.1,15.38 10.66,15.82 8.29,15.82 7.17,14.7 5.6,14.7 5.19,15.11 5.19,17.7 5.38,17.89 S0.3 | v21.56,17.87 21.55,17.86 21.3,17.86 20.69,18.44 | 6.7,17.8 6.64,17.86 6.64,18.48 8.15,20 S2.3 7.41,20.73 6.97,21.17 6.97,23.21 7.55,23.79 11.16,23.79 12.24,22.71 | C10.1 11.42,21.89 12.24,22.71 | U4.5 18.87,21.86 17.81,22.91 12.44,22.91 12.24,22.71
  Bottom 0.406: 20.69,18.44 v20.69,18.99 20.69,21 20.08,21.62 U4.5 | 10.06,12.3 F+.3
  Bottom 0.61: v13.1,10.73 11.63,10.73 10.06,12.3
6V  (via drill 0.35)
  Top 0.254: 82.91,22.49 82.9,22.48 82.9,21.82 SOL2+.P$1 | D1.C 77.59,7.21 77.42,7.21 | Q4.2 82.09,12.23
  Top 0.305: U2.1 U2.2 | v10.45,15.07 10.45,15.17 10.58,15.29 10.58,16.2 J1.3 | SOL2+.P$1 83.11,22.15 83.18,22.22
  Top 0.406: SOL2+1.P$1 85.64,21.59 | 87.62,21.52 S1-.P$1
  Top 0.508: S1-.P$1 87.84,23.09 v87.98,23.22 87.77,23.02 85.64,23.02 83.66,23.02 83.18,22.53 83.18,22.22 | D2.C 82.61,22.79 82.91,22.49
  Top 0.61: v6.09,8.75 6.14,8.71 U2.2 | v70.95,17.76 70.92,17.73 69.51,17.74 U$3.VCC | 85.64,21.59 85.64,23.02 | SOL2+1.P$1 87.62,21.52
  Top 0.813: 77.42,7.21 v75.98,7.21 | Q4.2 83.44,12.23 R20.1
  Top 1.016: ICSP.6 25.53,8.94 19.22,2.62 v19.09,2.62 | SOL1.SOL1+ 78.24,4.17 | 78.24,5.98 v78.18,6.04 | 8.82,7.43 v8.85,7.4 8.83,7.42 U2.1 | v88.53,12.31 88.4,12.18 83.58,12.18 R20.1 | v15.18,1.01 15.07,0.89 8.27,0.89 7.64,1.52 C1.2
  Top 1.27: U$1.VCC v88.53,12.31 | 78.24,5.98 78.24,4.17
  Bottom 0.254: 81.26,3.42 81.27,5.04
  Bottom 0.508: v87.98,23.22 86.98,23.22 86.14,22.38 86.14,19.37 86.14,19.36 86.14,14.7 86.09,14.7
  Bottom 0.61: 86.09,14.7 83.81,16.98 80.31,16.91 79.18,18.04 73.29,18.04 73.27,18.03 71.22,18.03 v70.95,17.76 | v10.45,15.07 8.62,15.07 8.02,14.54 | 8.02,14.54 7.68,14.23 | 7.68,14.23 6.05,12.78 6.07,10.72 6.08,9.95 v6.09,8.75 | 7.68,14.23 7.97,13.94 | F+.1 7.97,13.94 | 7.97,13.94 8.02,14.54 | 71.67,6.29 SEL_S4.3 SEL_S4.2 | 70.1,7.33 70.5,7.73 | 86.14,14.7 v88.53,12.31
  Bottom 0.813: SEL_S4.2 70.1,7.33
  Bottom 1.016: v19.09,2.62 18.75,2.29 18.75,1.01 | 18.76,1.01 18.75,1.01 | 18.75,1.01 v15.18,1.01 6.03,1.01 5.83,1.21 5.83,4.19 5.69,4.32 5.64,4.32 4.91,5.04 4.91,6.24 5.43,6.76 8.2,6.76 v8.85,7.4
  Bottom 1.27: 18.76,1.01 67.5,1.01 67.5,2.85 68.07,3.42 81.26,3.42 81.27,3.51 81.27,4.54 88.53,11.8 v88.53,12.31 | 70.5,7.73 75.46,7.73 | 75.46,7.73 v75.98,7.21 | v78.18,6.04 77.84,5.71 75.09,5.71 74.52,6.29 71.67,6.29 | 75.46,7.73 78.58,7.73 81.27,5.04
DTR
  Top 0.254: J1.6 9.05,15.9 8.66,15.51 8.66,13.34 9.46,12.54 10.77,12.54 C7.1
F-OUT  (via drill 0.35)  (1 unrouted)
  Top 0.305: U$2.F- 23.96,24.38 24.47,23.86 25.06,23.86 27.62,21.3 27.62,20.62 28.69,19.55 30.24,19.55 v30.28,19.52 | v33.92,21.59 33.94,21.61 35.97,21.6 41.67,25.51 57.79,25.51 60.6,22.71 63.16,22.71 64.03,21.84 64.03,21.53
  Bottom 0.305: v30.28,19.52 30.63,19.52 33.94,21.58 v33.92,21.59
FF  (via drill 0.35)
  Top 0.254: 26.16,22.05 25.17,23.03 23.05,23.03 22.26,22.25 21.77,22.25 20.88,23.13 19.5,23.13 19.14,23.48 U$2.FF | U1.2 21.23,16.49 21.51,16.77 23.77,16.77 25.29,18.61 26.57,18.61 v26.76,18.43 | v69.72,20.66 69.9,20.48 69.9,19.76 U$3.FF
  Top 0.305: 26.16,22.05 26.16,19 26.73,18.43 v26.76,18.43
  Bottom 0.254: v26.76,18.43 v26.75,18.42
  Bottom 0.305: v69.72,20.66 55.37,20.57 47.9,25.22 40.91,25.21 29.93,18.37 26.77,18.39 26.75,18.41 v26.75,18.42
FT  (via drill 0.35)
  Top 0.254: U$2.FT 20.79,23.91 21.82,22.88 v22,22.88 | v71.52,21.78 71.32,21.58 71.32,20.58 U$3.FT 71.68,18.63 TP4.P$1 | v23.52,8.34 25.42,10.24 26.83,10.24 28.63,12.03 28.63,16.5 28.66,16.52 28.66,16.54 28.92,16.74 28.99,16.81 32,19.08 32,20.31 30.69,21.62 v28.72,21.62 | v17.26,8.17 17.63,8.17 18.49,7.31 19.47,7.31 21.27,9.11 v21.73,9.11 | R24.1 11.5,3.49 11.33,3.66 11.33,3.64 v11.34,3.63
  Bottom 0.254: v22,22.88 22.16,23.03 24.71,23.03 26.12,21.62 v28.72,21.62 28.87,21.78 37.78,27.19 66.58,27.19 67.56,26.21 67.56,24.32 70.09,21.78 v71.52,21.78 | v23.52,8.34 23.5,8.36 22.48,8.36 v21.73,9.11 | v11.34,3.63 11.34,6.23 14.13,9.03 15.81,9.03 16.67,8.17 v17.26,8.17
FT@3.3V  (via drill 0.35)
  Top 0.254: R25.1 R24.2 13.71,3.49 12.98,2.76 11.34,2.76 10.72,3.38 v10.53,3.38 | v19.28,8.37 v19.28,8.36 17.6,10.04 17.6,12.96 U1.22 | v20.84,5.75 18.64,3.56 18.45,3.56 v18.43,3.57
  Bottom 0.254: v19.28,8.37 19.28,7.82 20.84,6.26 v20.84,5.75 | v18.43,3.57 17.88,3.02 11.09,3.02 10.72,3.38 v10.53,3.38
GND  (via drill 0.35)
  Top 0.254: U1.3 20.9,16.8 21.28,17.18 21.54,17.18 21.62,17.26 | U1.3 20.8,16.8 | U1.5 19.35,16.71 19.35,16.26 | U1.3 20.85,16.75 20.1,16 | 20.1,16 19.97,15.87 19.97,15.68 18.93,14.63 18.52,14.63 17.45,13.56 U1.21 | 18.77,15.48 19.29,16 20.1,16
  Top 0.305: v80.7,16.06 80.7,15.22 80.8,15.32 R10.2
  Top 0.406: R13.1 76.06,15.99 | R6.2 80.37,13.48 79.67,12.78 | R2.1 75.98,10.15 Q3.E | v78.5,12.35 78.61,12.46
  Top 0.508: C2.1 7.64,3.62 C4.1
  Top 0.61: U2.6 0.64,9.04 0.63,9.04 0.63,6.32
  other vias: 93.34,17.14 73.04,25.95 69.39,16.65 21.71,20.56 22.01,18.55 17.78,4.79 35.03,26.89 87.7,25.51 81.48,20.87 24,22.29 33.8,4.73 87.39,17.3 6.1,19.65 34.04,8.25 17.07,21.68 43.37,3.22 59.4,11.3 69.06,9.19 10.29,2.08 9.89,6.32 1.55,7.27 20.43,2.41 12.68,9.62 10.81,22.82 8.91,19.42 52.3,2.46
  pour Top: 91.73,22.14 91.8,22.14 95.92,22.14 95.92,5.67 84.44,5.67 84.19,5.62 83.87,5.5 83.51,5.3 83.15,5.04 82.81,4.71 82.54,4.33 82.35,3.9 82.27,3.43 82.27,2.44 68.51,2.44 68.51,0.03 4.2,0.03 4.2,3.63 4.15,3.93 3.98,4.25 3.73,4.59 3.4,4.92 3.02,5.21 2.59,5.45 2.15,5.61 1.7,5.67 0.04,5.67 0.04,13.85 2.63,13.87 2.85,13.99 3.01,14.18 3.11,14.42 3.14,14.68 3.11,14.94 3.01,15.18 2.85,15.37 2.63,15.48 0.04,15.49 0.04,19.31 2.63,19.31 3.18,19.39 3.64,19.59 4.03,19.9 4.34,20.28 4.57,20.73 4.73,21.2 4.83,21.68 4.86,22.14 4.86,25.97 15.14,25.97 25.13,26.07 25.2,27.89 71.75,27.89 72.56,27.1 89.59,27.1 89.59,24.24 89.65,23.93 89.79,23.59 90.01,23.24 90.28,22.9 90.61,22.6 90.96,22.36 91.34,22.2
  pour Bottom: 91.73,22.14 91.8,22.14 95.92,22.14 95.92,5.67 84.44,5.67 84.19,5.62 83.87,5.5 83.51,5.3 83.15,5.04 82.81,4.71 82.54,4.33 82.35,3.9 82.27,3.43 82.27,2.44 68.51,2.44 68.51,0.03 4.59,0.03 4.59,3.61 4.53,3.9 4.36,4.23 4.11,4.57 3.78,4.89 3.4,5.19 2.98,5.42 2.53,5.58 2.08,5.64 0.16,5.64 0.16,13.85 2.63,13.87 2.85,13.99 3.01,14.18 3.11,14.42 3.14,14.68 3.11,14.94 3.01,15.18 2.85,15.37 2.63,15.48 0.04,15.49 0.04,19.31 2.63,19.31 3.18,19.39 3.64,19.59 4.03,19.9 4.34,20.28 4.57,20.73 4.73,21.2 4.83,21.68 4.86,22.14 4.86,25.97 24.67,25.97 24.77,27.82 71.92,28.14 72.61,27.1 89.59,27.1 89.59,24.24 89.65,23.93 89.79,23.59 90.01,23.24 90.28,22.9 90.61,22.6 90.96,22.36 91.34,22.2
GTD  (via drill 0.35)
  Top 0.305: U1.28 20.65,13.53 21.52,12.81 26.33,12.81 26.76,13.24 v26.76,14.25 | v21.03,7.98 19.28,6.23 14.91,6.23 14.48,6.66 R17.2 14.48,6.89 13.14,5.54 R16.2
  Bottom 0.305: v26.76,14.25 26.65,14.14 32.82,10.15 32.88,6.46 30.95,4.53 24.55,4.53 21.09,7.98 v21.03,7.98
GTD@6V  (via drill 0.35)
  Top 0.305: v29.81,12.86 29.81,16.21 43.31,24.99 57.41,24.99 60.37,22.03 60.37,21.27 65.17,16.46 66.07,16.46 TP1.P$1 67.2,17.39 U$3.GTD | v15.56,8.4 13.97,8.4 13.14,7.58 R16.1
  Bottom 0.305: v29.81,12.86 29.91,12.75 37.33,8.05 37.28,3.54 35.96,2.01 21.82,2.01 15.56,8.34 v15.56,8.4
LED1  (via drill 0.35)
  Top 0.254: LED.P$2 | 15.84,14.65 | 15.84,14.65 15.76,14.57 15.62,14.43 15.59,13.37 v15.21,12.86 | U1.17 15.91,14.72 15.84,14.65
  Top 0.305: v28.17,22.86 v28.18,22.85 30.67,22.85 32.71,20.82 32.71,19.02 29.16,16.34 29.16,11.39 26.83,9.06 26.83,7.75 ICSP.2
  Top 0.508: LED.P$2 25.75,25.72 24.74,24.71 v24.74,24.49
  Bottom 0.254: v15.21,12.86 15.21,12.79 17.19,12.79 24.92,5.06 26.81,5.06 28.15,6.4 ICSP.2
  Bottom 0.508: v28.17,22.86 26.38,22.86 v24.75,24.49 v24.74,24.49
LED2
  Top 0.254: LED.P$1 25.84,27.24 26.19,27.24 26.54,26.89 26.54,23.02 28.01,21.82
  Top 0.305: U1.26 21.23,11.78 27.32,11.81 28.13,12.62 28.13,17.06 31.17,19.22 31.17,19.85 30.56,20.45 28.68,20.45 28.08,21.06 28.08,21.75 28.01,21.82
LM  (via drill 0.35)
  Top 0.254: U1.9 18.09,19.61 18.03,19.68
  Top 0.305: 18.03,19.68 17.42,20.28 v17.42,20.48
  Bottom 0.305: U4.6 18.15,20.34 18.02,20.48 v17.42,20.48
  Bottom 0.406: v17.42,20.48 17.42,20.53
MOTOR+
  Top 0.254: 19.46,12.63 20.92,11.3 24.36,11.3 24.36,10.24 19.38,5.26 17.89,3.93
  Top 0.305: 19.46,12.63 U1.25 | R7.1 17.89,3.93
MOTOR-HEADER  (via drill 0.35)
  Top 0.305: v66.49,8.08 65.23,9.75 57.36,9.75 44.7,1.08 | v87.24,6.69 84.4,6.69 83.05,8.04 82.76,8.04 v82.75,8.03
  Top 0.406: R7.2 17.11,1.04 44.7,1.08
  Top 0.61: U$1.MOTOR v92.68,12.2
  Bottom 0.305: 92.78,12.24 92.68,12.24 | v87.24,6.69 92.68,12.17 92.68,12.24 | v92.68,12.2 92.68,12.24 | v82.75,8.03 81.16,8.03 80.09,9.11 70.11,9.11 69.14,8.13 66.82,8.13 66.6,7.91 66.49,8.02 v66.49,8.08
N$1
  Top 0.305: Q1.1 82.96,9.16 81.9,8.1 79.75,8.08 R1.2 78.87,8.71 78.1,9.49 76.85,9.49 R2.2
N$2
  Top 0.254: LED.P$4 27.76,26.02 35.87,26.05 36.69,26.87 62.41,26.88 R18.1
N$3
  Top 0.254: R4.2 78.59,19.9 R3.2
  Top 0.508: Q2.1 86.04,24.22 81.62,24.22 80.07,22.68 R4.2
N$4
  Top 0.254: X1.IN 20.39,20.22 19.55,19.08 19.55,18.31 U1.7
N$5  (via drill 0.35)
  Top 0.305: U$2.F+ 16.53,24.12 | v13.98,24.11 13.84,24.11 13.82,24.12
  Top 0.406: 13.82,24.12 16.53,24.12
  Bottom 0.61: F+.2 8.99,9.05 7.72,7.78 5.45,7.78 3.75,9.47 3.75,18.72 5.46,20.42 5.47,20.42 5.54,20.49 5.54,25.16 11.32,25.16 12.4,24.09 13.96,24.09 v13.98,24.11
N$6
  Top 0.254: U1.8 18.94,19.34 18.47,19.81 X1.OUT
N$7
  Top 0.406: Q3.C 79.13,10.33 Q4.1
  Top 0.813: Q4.1 83.44,10.33 R20.2
N$8
  Top 0.406: R23.2 74.4,10.51 75.98,12.1 Q3.B
N$10
  Top 0.305: 7.51,12.55 U2.5
  Top 0.508: C2.2 6.12,3.68 3.77,6.03 3.77,10.61 5.71,12.55 7.51,12.55
N$11
  Top 0.305: LED.P$3 29.83,27.32 29.84,26.95 29.85,26.94 R11.2
RST  (via drill 0.35)
  Top 0.254: C7.2 R12.1 11.1,9.51 11.68,9.51 11.98,9.21 11.98,4.63 12.38,4.23 15.12,4.23 15.12,3.43 15.35,3.2 17.22,3.2 18.69,1.73 26.49,1.73 30.44,5.69 30.72,5.97 | U1.29 | U1.29 20.74,14.16 | v25.86,13.46 | U1.29 20.67,14.22 20.74,14.16 | 20.74,14.16 20.97,13.94
  Top 0.305: 20.97,13.94 21.54,13.46 v25.86,13.46 | 30.72,5.97 ICSP.3
  Bottom 0.305: v25.86,13.46 26.7,13.46 31.98,9.95 31.96,7.63 ICSP.3
RXD  (via drill 0.35)
  Top 0.254: J1.4 10.05,15.6 9.66,15.2 9.67,14.34 12.77,14.34 v13.61,15.19 | v23.72,14.13 23.52,13.93 21.79,13.92 U1.30
  Bottom 0.254: v13.61,15.19 13.61,15.39 17.5,15.39 18.96,13.94 23.53,13.94 v23.72,14.13
S0
  Bottom 0.305: S0.2 9.4,16.87 10.34,17.8 U4.1
S1F-FFLEX
  Top 0.508: U$6.S2-SONAR 30.81,24.52 31.54,23.9 37.85,23.9 41.35,26.22 58.41,26.2 61.05,23.37 72.94,23.38 U$3.S1F
  Top 0.61: SEL_S1F.2 75.73,20.47 U$3.S1F
S1F@3.3V  (via drill 0.35)
  Top 0.305: v12.65,15.98 13.35,16.75 16.1,16.75 16.28,16.62 U1.14 | v54.89,23.06 56.49,23.06 65.87,13.67 67.27,13.67 67.28,13.66 68.34,13.66 69.59,14.91 69.6,15.54 70.73,16.66 72.57,16.68 74.19,15.06 75.01,15.06 R8.1
  Top 0.508: R13.2 R8.1
  Bottom 0.254: v12.65,15.98 12.65,16.24 18.48,16.24 19.55,15.17 24.49,15.17 24.74,15.42 24.74,19.61 25.08,19.99 28.53,19.99 38.74,26.18 51.77,26.21 54.89,23.08 v54.89,23.06
S1F@6V
  Top 0.508: S1F+.P$1 89.68,19.61 89.03,18.96 77.43,18.96 77.27,18.8 | R8.2 77.27,18.81
  Top 0.61: SEL_S1F.1 77.27,18.81 77.27,18.8
S1F@6VFBW  (via drill 0.35)
  Top 0.254: Q4.3 79.72,11.33
  Top 0.406: R22.2 72.84,12.06 72.69,12.06 | v80.35,12.3 80.35,11.84 Q4.3
  Top 0.61: v73.61,17.23 73.61,18.19 74.79,18.9 74.8,19.44 SEL_S1F.3 | v71.91,11.91 72.06,12.06 72.69,12.06 72.78,12.15
  Bottom 0.61: v80.35,12.3 79.74,11.44 77.3,11.44 74.26,14.49 | v73.61,17.23 74.28,16.56 74.26,14.49 | v71.91,11.91 71.85,11.91 71.85,12.01 73.59,13.75 74.26,14.49
S1F@FBW  (via drill 0.35)
  Top 0.254: U1.32 23.77,15.31 25.09,15.31 25.79,16.01 v25.79,16.16 | v68.95,15.26 68.84,15.37 v66.51,15.39
  Top 0.406: v74.41,13.2 74.41,12.15 R23.1
  Bottom 0.254: v25.79,16.16 27.38,16.16 41.23,24.74 41.25,24.76 47.66,24.77 62.8,15.45 66.46,15.41 66.5,15.41 v66.51,15.39 | v74.41,13.2 74.41,12.25 73.61,11.37 73.38,11.15 71.65,11.15 71.26,11.53 71.26,12.38 68.95,14.69 v68.95,15.26
S1T@3.3V  (via drill 0.35)
  Top 0.254: U1.16 15.82,15.62 15.21,15.62 15.21,14.08 v14.93,13.8
  Top 0.305: 61.54,13.2 60.97,13.2 60.84,13.2 60.36,13.21 47.41,4.59 36.78,4.61 31.88,7.65 30.41,7.65 29.61,6.85 29.61,5.59 28.68,4.67 26.93,4.67 25.64,5.95 ICSP.1 | 61.54,13.2 68.5,13.19 68.51,13.21 68.96,13.21 70.09,14.34 70.09,15.29 70.97,16.17 72.34,16.18 72.98,15.6 74.27,14.31 78.07,14.31 78.38,15.31 | SEL_F-.1 63.01,19.67 v63.99,18.68 | v60.83,17.55 v60.83,17.54 60.83,13.71 61.33,13.2 61.54,13.2
  Top 0.406: R15.2 79.88,16.8 78.4,15.32 | 78.4,15.32 78.38,15.31 | 78.4,15.32 R14.1
  Bottom 0.254: 17.94,13.51 15.22,13.51 v14.93,13.8 | 17.94,13.51 | 17.94,13.51 22.69,9.08 22.81,8.99 24.31,8.99 25.24,9.91 26.36,9.91 26.72,9.55 26.72,8.27 25.64,7.19 ICSP.1
  Bottom 0.305: v63.99,18.68 62.86,17.55 v60.83,17.55
S1T@6V  (via drill 0.35)
  Top 0.305: U$3.S1T 72.4,21.73 72.4,22 71.98,22.41 65.73,22.41 65.04,21.73 SEL_F-.3
  Top 0.508: 93.92,20.77 93.85,20.83 93.81,20.91 93.8,20.91 93.72,20.96 93.67,21.03 93.66,21.03 93.57,21.06 93.47,21.16 92.72,21.16 S1T+.P$1 | 93.92,20.77 | 93.92,20.77 93.95,20.68 94.05,20.58 94.05,19.41 93.98,19.34 93.98,19.22 93.92,19.22 93.86,19.16 93.85,19.16 93.81,19.08 93.8,19.08 93.72,19.04 93.67,18.96 93.66,18.96 93.57,18.94 93.48,18.84 92.92,18.84 | 92.92,18.84 92.05,18.84 91.81,18.6 89.61,18.6 89.28,18.28 81.72,18.28 v81.67,18.23 81.64,18.2 79.58,18.2 78.33,16.96 R14.2 | 92.92,18.84 | U$3.S1T 73.24,20.73 73.23,19.64 v73.56,19.31
  Bottom 0.406: v73.56,19.31 73.59,19.28 80.49,19.24 v81.67,18.23
S2
  Bottom 0.254: U4.7 18.78,19.16 17.89,19.09 16.66,20.33 15.87,20.33 15.23,19.69
  Bottom 0.305: S2.2 8.29,21.88 10.61,21.88 10.61,20.03 11.93,20.03 12.27,19.69 15.23,19.69
S3  (via drill 0.35)
  Top 0.254: U1.12 17.09,17.18 14.78,19.49 14.78,21.32 16.06,22.63 20.71,22.65 22.35,21.01 23.54,21.01 23.72,20.83 24.22,20.83 24.33,20.94 25.71,20.94 25.71,20.72 25.72,20.7 25.72,19.71 25.37,19.35 v25.37,19.28
  Top 0.305: U$1.S3 92.47,8.37 88.34,8.37 85.85,10.86 84.79,10.86 v84.75,10.82 | v63.98,11.22 64.27,10.94 68.36,10.94 69.03,11.61 v69.03,11.64
  Bottom 0.254: 42.21,24.3 28.01,15.5 25.18,15.51 25.15,19.07 v25.37,19.28
  Bottom 0.305: 42.21,24.3 47.18,24.31 63.97,14.1 v63.98,11.22 | v69.03,11.64 69.95,10.72 84.65,10.72 v84.75,10.82
S4@3.3V  (via drill 0.35)
  Top 0.254: U1.19 16.48,13.97 16.42,11.15 16.42,7.88 17.02,7.28 v17.54,7.28 | v36.31,3.44 36.34,3.42 v38.64,3.42
  Top 0.305: R21.2 17.2,6.98 17.51,7.28 v17.54,7.28
  Top 0.813: 74.51,3.97 S4.SOL1+
  Top 1.27: 74.51,3.97 R19.1 71.2,3.97 v70.29,4.88
  Bottom 0.254: v17.54,7.28 17.54,7.2 22.28,2.46 35.33,2.46 v36.31,3.44 | v38.64,3.42 39.6,2.46 45.57,2.46 54.24,8.32 65.41,8.23 67.35,6.29 SEL_S4.1 69.09,5.64
  Bottom 1.016: v70.29,4.88 v70.28,4.86 69.59,4.86 69.09,5.37 69.09,5.64
S4B
  Top 1.016: R19.2 72.6,5.5 73.21,6.11 76.39,6.11 76.39,4.23 S4.SOL1-
S5  (via drill 0.35)
  Top 0.254: U1.11 16.35,18.58 v16.35,19.72
  Top 0.305: U$1.S5 93.2,6.94 88.85,6.94 85.58,10.21 v85.33,10.21 | v29.14,3.07 30.44,1.77 44.38,1.8 57.35,10.44 68.99,10.44 v68.99,10.43
  Bottom 0.254: v29.14,3.07 28.55,3.09 23.63,3.1 22.27,3.1 18.14,7.23 18.14,8.61 12,14.75 12,16.25 12.47,16.71 16.07,16.71 16.13,16.77 16.22,16.77 16.58,17.13 16.58,17.7 16.38,17.9 16.38,17.95 | v16.35,19.72 16.35,18.91 16.35,18.89 16.38,18.86 16.38,18.57 16.37,18.56 16.38,17.95 | 16.38,17.95
  Bottom 0.305: v85.33,10.21 85.28,10.16 69.25,10.16 v68.99,10.43
S8@3.3V  (via drill 0.35)
  Top 0.305: U1.24 18.6,10.5 v18.92,10.18 | v45.75,3.49 45.15,4.09 31.05,4.07 v30.57,3.59 | 83.03,16.82 R9.2
  Top 0.508: R10.1 83.03,16.82 83.04,16.82 84.26,16.82 v84.83,17.39
  Bottom 0.305: v18.92,10.18 20.55,8.54 20.21,7.81 24,3.94 30.17,3.99 v30.57,3.59 | v45.75,3.49 53.81,8.82 67.24,8.82 67.54,9.12 67.54,16.09 70.12,18.66 74.43,18.66 74.48,18.71 79.9,18.71 81.01,17.59 84.63,17.59 v84.83,17.39
S8@6V
  Top 0.305: U$1.S8 88.66,16.26 88.3,16.62
  Top 0.406: R9.1 83.1,15.37 85.62,15.37 88.3,16.62
S9@3.3V  (via drill 0.35)
  Top 0.254: U1.23 18.21,12.8 18,12.59 18,10.23 18.67,9.57 19.17,9.57 20.26,10.66 v23.35,10.66
  Top 0.305: U1.23 18.11,12.75 | R5.2 81.13,14.38 79.62,14.38 R6.1 78.6,13.85 72.81,13.85 71.45,12.68 65.98,12.68 v65.56,12.27
  Bottom 0.254: 42.5,23.8 28.26,15.06 25.24,15.09 24.41,14.26 24.41,12.14 24.41,11.72 v23.35,10.66
  Bottom 0.305: 42.5,23.8 47.02,23.79 62.91,14.06 62.9,10.64 63.5,10.16 64.79,10.17 65.56,10.94 v65.56,12.27
S9@6V
  Top 0.406: U$1.S9 89.41,14.72 87.83,14 83.78,13.96 R5.1
SDA_S2  (via drill 0.35)
  Top 0.254: S2+.P$1 65.42,26.34 64.59,26.34 64.16,25.91 v64.16,24.19 v64.15,24.18
  Top 0.305: v25.87,17.45 26.02,17.29 26.15,17.29 27.53,15.92 27.53,12.93 26.88,12.3 21.38,12.3 U1.27 | U$5.S2-SONAR 10.28,24.3 | v12.82,25.14 12.78,25.18 10.32,25.17 U$5.S2-SONAR | v31.3,25.34 31.82,24.82 37.88,24.82 v37.9,24.84 | U$5.S2-SONAR 9.86,20.7 v9.79,20.63 | v10.29,18.86 10.29,17.62 11.05,16.85 J1.2
  Top 0.508: S2+.P$1 65.72,26.47 66.67,26.47 67.46,25.68 67.46,24.8 68.1,24.15 74.45,24.15 U$3.S2
  Bottom 0.254: 39.03,25.66 48.65,25.69 55.74,21.36
  Bottom 0.305: 55.74,21.36 61.33,21.36 v64.15,24.18 | v25.87,17.45 25.96,17.45 25.96,18.57 26.82,19.44 28.89,19.44 37.73,24.84 v37.9,24.84 37.9,24.95 39.03,25.66 | v12.82,25.14 12.93,25.25 31.21,25.25 v31.3,25.34 | v9.79,20.63 9.9,20.52 9.9,19.25 v10.29,18.86
SOL1  (via drill 0.35)
  Top 0.305: U1.1 23.88,16.16 25.56,18.12 26.14,18.11 26.62,17.64 27.41,17.94 27.4,19.05 26.7,19.74 26.7,20.5 v26.82,20.62 | v65.94,14.59 65.78,14.59 56.61,23.75 v56.61,24.24 | v66.85,9.51 66.93,9.49 68.12,7.93 77.19,7.93 R1.1
  Bottom 0.305: v56.61,24.24 56.58,24.24 54.1,26.72 38.39,26.64 28.5,20.63 26.83,20.63 v26.82,20.62
  Bottom 0.406: v65.94,14.59 66.92,13.61 66.92,9.57 v66.85,9.51
SOL1-
  Top 0.508: 82.62,6.77 Q1.3 82.54,6.98 80.82,6.98 D1.A
  Top 1.016: SOL1.SOL1- 82.62,6.77
SOL2  (via drill 0.35)
  Top 0.254: R3.1 78.59,22.08 78.12,22.55 77.78,22.55 v77.74,22.5 | U1.15
  Top 0.305: v57.75,19.71 59.71,17.82 59.74,13.47 47.2,5.2 40.84,5.25 32.31,10.45 29.01,10.45 28.18,9.62 ICSP.5 | U1.15 15.92,16.28 15.12,16.28 14.63,15.79 14.63,14.78 v14.6,14.75
  Bottom 0.254: v14.6,14.75 14.96,14.75 14.97,14.76 17.43,14.76 23.13,9.45 24.11,9.46 24.71,10.07 24.82,10.07 25.07,10.32 26.96,10.32 28.18,9.1 ICSP.5
  Bottom 0.305: v77.74,22.5 77.74,20.75 76.96,19.97 65.92,19.99 63.62,19.98 63.34,19.71 v57.75,19.71
SOL2-
  Top 0.508: SOL2-.P$1 80.74,26.42 D2.A 83.68,25.59 Q2.3
TCS3200_S1  (via drill 0.35)
  Top 0.254: U1.13 16.31,17.19 16.04,17.39 v15.97,17.38
  Bottom 0.254: v15.97,17.38 15.9,17.45 15.89,18.38 14.83,19.25 13.84,19.25 U4.2
TCS3200_S3  (via drill 0.35)
  Top 0.254: U1.10 17.27,18.45 v17.27,18.56
  Bottom 0.254: U4.8 18.01,17.8 v17.26,18.55 v17.26,18.56 v17.27,18.56
TXD  (via drill 0.35)
  Top 0.254: J1.5 9.55,15.67 9.16,15.28 9.16,14.27 9.58,13.83 13.76,13.86 v13.98,14.22
  Top 0.305: U1.31 21.91,14.51 v22.99,14.55
  Bottom 0.254: v13.98,14.22 13.23,14.69 12.77,15.21 13.36,15.81 14.35,15.8 18.22,15.8 19.58,14.45 22.89,14.45 v22.99,14.55

### Text on the board
Top: TOP
Bottom: BOTTOM
Dimension: CUT OUT | CUT OUT | CUT OUT | CUT OUT | CUT OUT | CUT OUT | CUT OUT | CUT OUT / PCB 0.6mm width | CUT OUT
bPlace: layout SONAR FBW | GND | 1 | LIGHT / METER | VCC | MOSI | GND | ICSP / BOTTOM | MISO | SCK | RST
tNames: LED | A+ | GND | F-O | S2 | GND | F+ | FF | FT | S1F | S2+ | S2- | S1F | SOL2- | S2+ | 3.3 6V* | S1T | S1C | FT | S1F | FTDI | FF | SOL2+ | VCC | S1T | J1 | S2+ / 1-W | layout 8.9.3.8 | GTD | FT | S8 | 20200509 | S9 | GTD | 6V | DTR | TXD | RXD | VCC | GND | U1 | MOTOR | GND | 3.3V | FBW | Q4 | 6V | MOSI | GND | S3 | GND | 6V | S5 | S4 | S4A | S4B | MISO | SCK | RST | SOL1+ | SOL1- | GTD S4 | SONAR FBW / TCS3200 | FT | MOTOR
bNames: U4 | SEL / 3.3V-6V | S4A-S4B | ALPHA
tDocu: Creative Commons "Attribution-NonCommercial 4.0 International (CC BY-NC 4.0)" / https://creativecommons.org/licenses/by-nc/4.0/ | openSX70 project visit www.openSX70.com / version 8.9.3.8 "SONAR FBW TCS3200/T" 20200509 / IMPORTANT: 0.6mm width PCB!!!! / SILKSCREEN AND REGISTRATION IS SPECIALLY IMPORTANT! / / by Joaquín de Prada